# EasyEDA Pro project 光磁共振实验仪.eprj, schematic 恒流源模块
Create Date: 2025-03-18; Page Name: P1; Project Name: 光磁共振实验仪; Schematic Name: 恒流源模块; Update Date: 2025-04-30; Company: 嘉立创EDA; Page Size: A4; Version: V1.0
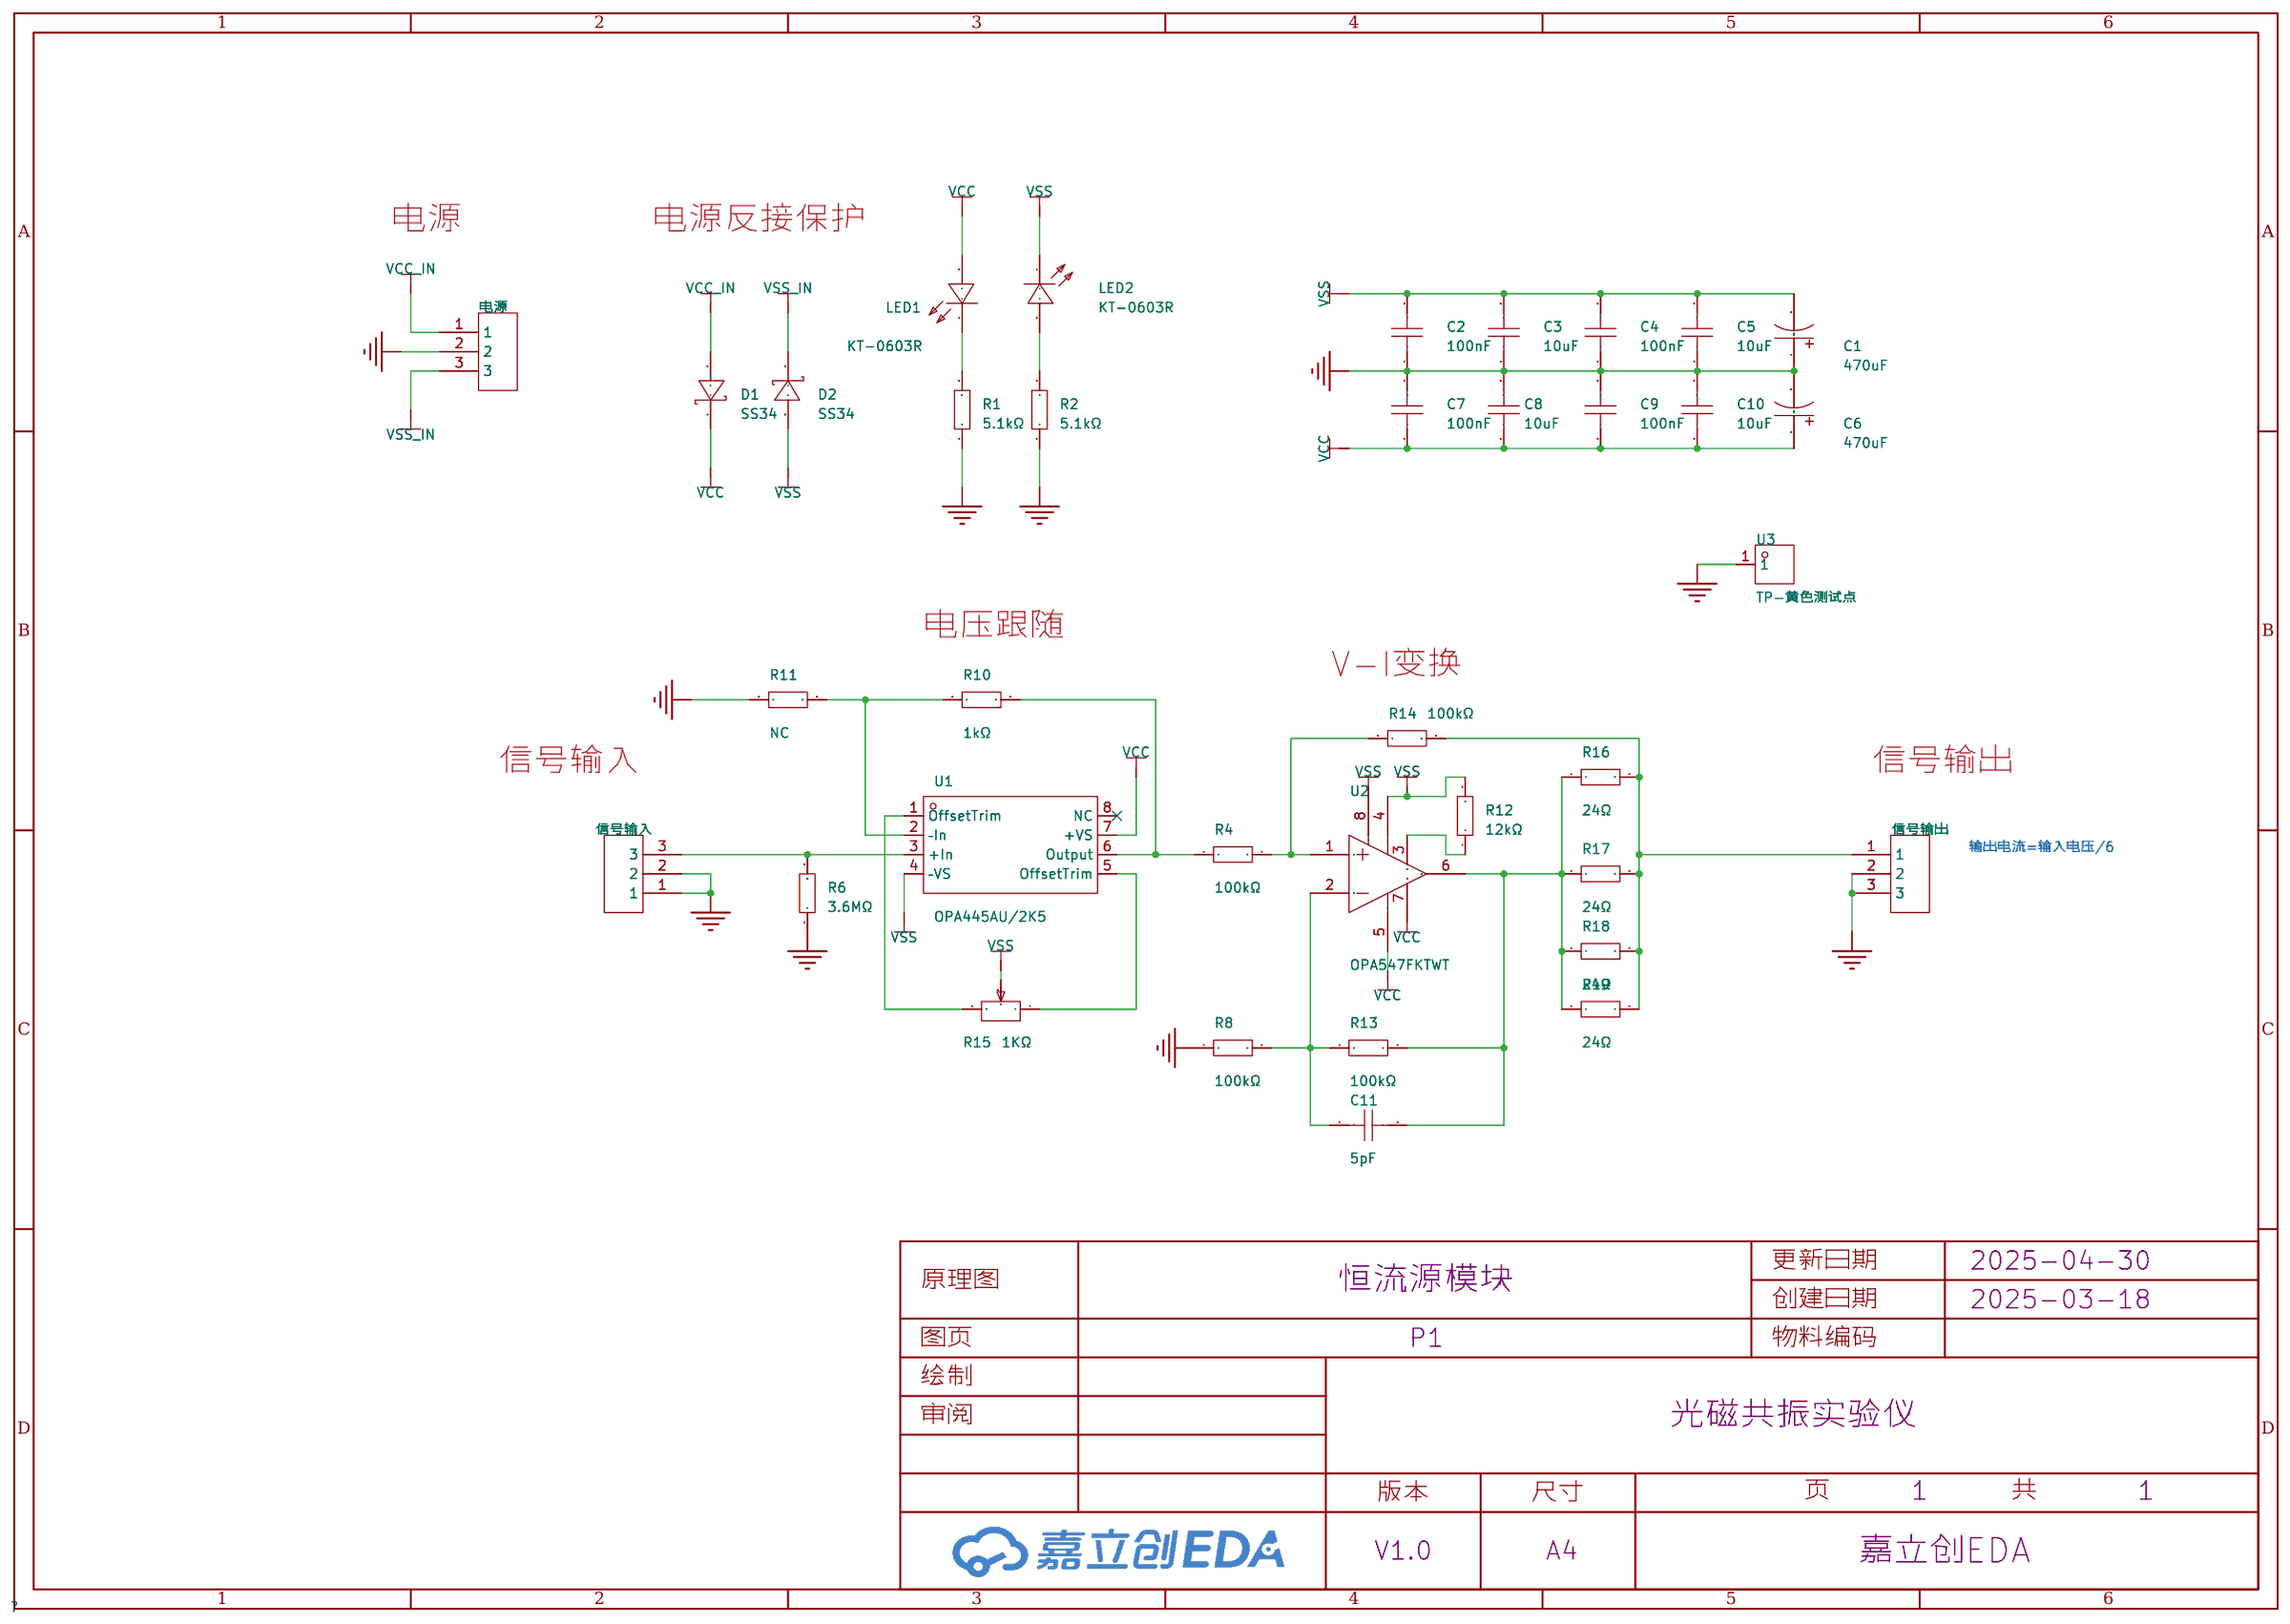
[diagram p3: schematic sheet]

## Parts
C1  470uF  [cap-th_bd8.0-p3.50-d0.6-fd_1]
C2  100nF  [C0603]
C3  10uF  [C0603]
C4  100nF  [C0603]
C5  10uF  [C0603]
C6  470uF  [cap-th_bd8.0-p3.50-d0.6-fd_1]
C7  100nF  [C0603]
C8  10uF  [C0603]
C9  100nF  [C0603]
C10  10uF  [C0603]
C11  5pF  [C0603]
D1  SS34  [SMA_L4.3-W2.6-LS5.2-RD]
D2  SS34  [SMA_L4.3-W2.6-LS5.2-RD]
LED1  KT-0603R  [LED0603-RD]
LED2  KT-0603R  [LED0603-RD]
R1  5.1kΩ  [R0603]
R2  5.1kΩ  [R0603]
R4  100kΩ  [R0603]
R6  3.6MΩ  [R0603]
R8  100kΩ  [R0603]
R10  1kΩ  [R0603]
R11  NC  [R0603]
R12  12kΩ  [R0603]
R13  100kΩ  [R0603]
R14  100kΩ  [R0603]
R15  1KΩ  [RES-ADJ-TH_3296W]
R16  24Ω  [R2512]
R17  24Ω  [R2512]
R18  24Ω  [R2512]
R19  24Ω  [R2512]
U1  OPA445AU/2K5  [SOIC-8_L4.9-W3.9-P1.27-LS6.0-BL]
U2  OPA547FKTWT  [DDPAK-7_L10.2-W8.9-P1.27-LS14.0-BR]
U3  TP-黄色测试点  [TESTPOINT-TH_BD3.2]
信号输入  -  [CH2.54-3插座]
信号输出  -  [CH2.54-3插座]
电源  -  [CH2.54-3插座]

## Library data of the parts
C1 C6 = RVT1A471M0607_C335982: 容值:470uF;精度:±20%;额定电压:10V;纹波电流:200mA@120Hz;等效串联电阻:-;; LCSC Part Name: 470uF ±20% 10V; Supplier Part: C335982; Manufacturer: ROQANG(容强); Manufacturer Part: RVT1A471M0607; Supplier Footprint: SMD,D6.3xL7.7mm; Datasheet: https://atta.szlcsc.com/upload/public/pdf/source/20181128/C335987_23CA7AA50FB42690DF736C43FE112376.pdf; Supplier: LCSC; Tolerance: ±20%; Rated Voltage: 10V; Ripple Current: 200mA@120Hz; φD: 6.3mm; L: 7.7mm; Lifetime @ Temp: 2000hrs@105℃; Operating Temperature: -40℃~+105℃
C2 C4 C7 C9 = CC0603KRX7R9BB104: 容值:100nF;精度:±10%;额定电压:50V;材质(温度系数):X7R;; LCSC Part Name: 100nF ±10% 50V; Supplier Part: C14663; Manufacturer: YAGEO(国巨); Supplier Footprint: 0603; JLCPCB Part Class: 基础库; Datasheet: https://atta.szlcsc.com/upload/public/pdf/source/20180910/C282072_33301C7F631E79921B82A8DAC6BCC5B3.pdf; Supplier: LCSC; Tolerance: ±10%; Voltage Rated: 50V; Temperature Coefficient: X7R
C3 C5 C8 C10 = CL10A106MA8NRNC: 容值:10uF;精度:±20%;额定电压:25V;材质(温度系数):X5R;; LCSC Part Name: 10uF ±20% 25V; Supplier Part: C96446; Manufacturer: SAMSUNG(三星); Supplier Footprint: 0603; JLCPCB Part Class: 基础库; Datasheet: https://atta.szlcsc.com/upload/public/pdf/source/20160218/1457707763339.pdf; Supplier: LCSC; Tolerance: ±20%; Voltage Rated: 25V; Temperature Coefficient: X5R
C11 = CGA3E2C0G2A050C080AA: 容值:5pF;额定电压:100V;材质(温度系数):C0G;; LCSC Part Name: 5pF 100V ±0.25pF; Supplier Part: C3879212; Manufacturer: TDK; Supplier Footprint: 0603; JLCPCB Part Class: 扩展库; Datasheet: https://atta.szlcsc.com/upload/public/pdf/source/20230606/D94174B26D5D12F87246C65F1689D091.pdf; Supplier: LCSC; Voltage Rated: 100V; Temperature Coefficient: C0G
D1 D2 = SS34_C8678: 二极管配置:独立式;正向压降(Vf):550mV@3A;直流反向耐压(Vr):40V;整流电流:3A;; LCSC Part Name: 电压:40V 电流:3A; Supplier Part: C8678; Manufacturer: MDD(辰达半导体); Supplier Footprint: SMA(DO-214AC); JLCPCB Part Class: 基础库; Datasheet: https://atta.szlcsc.com/upload/public/pdf/source/20240710/2118BB86FDDB2E0B294389AC1F3F65C8.pdf; Supplier: LCSC; Diode Configuration: 独立式; Forward Voltage (Vf@If): 550mV@3A; Reverse Voltage (Vr): 40V; Rectified Current: 3A; Reverse Leakage Current (Ir): 500uA@40V
LED1 LED2 = KT-0603R: 发光颜色:红色;功率:-;正向电流:-;主波长:-;二极管配置:-;透镜颜色:-;色温:-;发光角度:-;载带方式:-;工作温度:-40℃~+85℃;; LCSC Part Name: 0603 红灯 高亮; Supplier Part: C2286; Manufacturer: KENTO; Supplier Footprint: 0603; JLCPCB Part Class: 基础库; Datasheet: https://atta.szlcsc.com/upload/public/pdf/source/20160616/1466072038404.pdf; Supplier: LCSC; Emitted Color: 红色; Operating Temperature: -40℃~+85℃
R1 R2 = 0603WAF5101T5E: 电阻类型:厚膜电阻;阻值:5.1kΩ;精度:±1%;功率:100mW;最大工作电压:75V;温度系数:±100ppm/℃;; LCSC Part Name: 5.1kΩ ±1% 100mW 厚膜电阻; Supplier Part: C23186; Manufacturer: UNI-ROYAL(厚声); Supplier Footprint: 0603; JLCPCB Part Class: 基础库; Datasheet: https://atta.szlcsc.com/upload/public/pdf/source/20200306/C422600_1E6D84923E4A46A82E41ADD87F860B5C.pdf; Supplier: LCSC; Type: 厚膜电阻; Tolerance: ±1%; Power(Watts): 100mW; Overload Voltage (Max): 75V; Temperature Coefficient: ±100ppm/℃; Operating Temperature Range: -55℃~+155℃
R4 R8 R13 R14 = 0603WAF1003T5E: 电阻类型:厚膜电阻;阻值:100kΩ;精度:±1%;功率:100mW;最大工作电压:75V;温度系数:±100ppm/℃;; LCSC Part Name: 100kΩ ±1% 100mW 厚膜电阻; Supplier Part: C25803; Manufacturer: UNI-ROYAL(厚声); Supplier Footprint: 0603; JLCPCB Part Class: 基础库; Datasheet: https://atta.szlcsc.com/upload/public/pdf/source/20200306/C422600_1E6D84923E4A46A82E41ADD87F860B5C.pdf; Supplier: LCSC; Type: 厚膜电阻; Tolerance: ±1%; Power(Watts): 100mW; Overload Voltage (Max): 75V; Temperature Coefficient: ±100ppm/℃; Operating Temperature Range: -55℃~+155℃
R6 = RTT03365JTP: 电阻类型:厚膜电阻;阻值:3.6MΩ;精度:±5%;功率:100mW;最大工作电压:75V;温度系数:±100ppm/℃;; LCSC Part Name: 厚膜电阻 3.6MΩ ±5% 100mW; Supplier Part: C103584; Manufacturer: RALEC(旺诠); Supplier Footprint: 0603; JLCPCB Part Class: 扩展库; Datasheet: https://atta.szlcsc.com/upload/public/pdf/source/20191219/C158410_884373A5B7E1BC76BF57BC45A946C093.pdf; Supplier: LCSC; Type: 厚膜电阻; Tolerance: ±5%; Power(Watts): 100mW; Overload Voltage (Max): 75V; Temperature Coefficient: ±100ppm/℃; Operating Temperature Range: -55℃~+155℃
R10 R11 = 0603WAF1001T5E: 电阻类型:厚膜电阻;阻值:1kΩ;精度:±1%;功率:100mW;最大工作电压:75V;温度系数:±100ppm/℃;; LCSC Part Name: 1kΩ ±1% 100mW 厚膜电阻; Supplier Part: C21190; Manufacturer: UNI-ROYAL(厚声); Supplier Footprint: 0603; JLCPCB Part Class: 基础库; Datasheet: https://atta.szlcsc.com/upload/public/pdf/source/20200306/C422600_1E6D84923E4A46A82E41ADD87F860B5C.pdf; Supplier: LCSC; Type: 厚膜电阻; Tolerance: ±1%; Power(Watts): 100mW; Overload Voltage (Max): 75V; Temperature Coefficient: ±100ppm/℃; Operating Temperature Range: -55℃~+155℃
R12 = 0603WAF1202T5E: 电阻类型:厚膜电阻;阻值:12kΩ;精度:±1%;功率:100mW;最大工作电压:75V;温度系数:±100ppm/℃;; LCSC Part Name: 12kΩ ±1% 100mW 厚膜电阻; Supplier Part: C22790; Manufacturer: UNI-ROYAL(厚声); Supplier Footprint: 0603; JLCPCB Part Class: 基础库; Datasheet: https://atta.szlcsc.com/upload/public/pdf/source/20200306/C422600_1E6D84923E4A46A82E41ADD87F860B5C.pdf; Supplier: LCSC; Type: 厚膜电阻; Tolerance: ±1%; Power(Watts): 100mW; Overload Voltage (Max): 75V; Temperature Coefficient: ±100ppm/℃; Operating Temperature Range: -55℃~+155℃
R15 = 环保 3296W-1-202LF: 阻值:-;功率:-;; LCSC Part Name: 2KΩ ±10% ±250ppm/℃; Supplier Part: C5028; Supplier Footprint: 3296W; JLCPCB Part Class: 扩展库; Supplier: LCSC
R16-R19 = CRH2512F24R0E04Z: 电阻类型:厚膜电阻;阻值:24Ω;精度:±1%;功率:2W;最大工作电压:200V;温度系数:±100ppm/℃;; LCSC Part Name: 厚膜电阻 24Ω ±1% 2W; Supplier Part: C175254; Manufacturer: EVER OHMS(天二科技); Supplier Footprint: 2512; JLCPCB Part Class: 扩展库; Datasheet: https://atta.szlcsc.com/upload/public/pdf/source/20190415/C175809_DD1C9F6158BC05995187FFAA24C3E24C.pdf; Supplier: LCSC; Type: 厚膜电阻; Tolerance: ±1%; Power(Watts): 2W; Overload Voltage (Max): 200V; Temperature Coefficient: ±100ppm/℃; Operating Temperature Range: -55℃~+155℃
U1 = OPA445AU/2K5: OPA445 高电压 FET 输入运算放大器; Supplier Part: C1348606; Manufacturer: TI(德州仪器); Supplier Footprint: SOIC-8; JLCPCB Part Class: 扩展库; Datasheet: https://www.ti.com/cn/lit/gpn/opa445; Supplier: LCSC
U2 = OPA547FKTWT: 放大器数:单路;增益带宽积(GBP):1MHz;输入偏置电流(Ib):100nA;压摆率(SR):6V/us;带宽(-3db):-;; Supplier Part: C2057541; Manufacturer: TI(德州仪器); Supplier Footprint: TO-263-7; JLCPCB Part Class: 扩展库; Datasheet: https://www.ti.com/cn/lit/gpn/opa547; Supplier: LCSC; Number of Circuits: 单路; Gain Bandwidth Product(GBP): 1MHz; Current - Input Bias(Ib): 100nA; Slew Rate(SR): 6V/us; Output Current: 750mA; Operating Temperature: -40℃~+85℃
U3 = TP-黄色测试点: Supplier Part: C9900007422; Supplier Footprint: TESTPOINT-TH_BD-2P-P2.00; JLCPCB Part Class: 扩展库; Supplier: LCSC
信号输入 信号输出 电源 = HDR-3P

## Nets
GND: C1.1 C2.1 C3.1 C4.1 C5.1 C6.2 C7.2 C8.2 C9.2 C10.2 R1.1 R2.1 R6.1 R8.1 R11.1 U3.1 信号输入.1 信号输入.2 信号输出.2 信号输出.3 电源.2
VCC: C6.1 C7.1 C8.1 C9.1 C10.1 D1.1(K) LED1.2(A) U1.7(+VS) U2.5(V+) U2.7(E/S)
VCC_IN: D1.2(A) 电源.1
VSS: C1.2 C2.2 C3.2 C4.2 C5.2 D2.2(A) LED2.1(K) R12.2 R15.2 U1.4(–VS) U2.4(V-) U2.8(V-)
VSS_IN: D2.1(K) 电源.3
$1N1624: R10.1 R11.2 U1.2(–In)
$1N1631: R4.1 R10.2 U1.6(Output)
$1N1633: C11.1 R8.2 R13.1 U2.2(IN-)
$1N1634: C11.2 R13.2 R16.1 R17.1 R18.1 R19.1 U2.6(OUT)
$1N1636: R4.2 R14.1 U2.1(IN+)
$1N1639: R12.1 U2.3(ILIM)
$1N1642: R14.2 R16.2 R17.2 R18.2 R19.2 信号输出.1
$1N1651: R6.2 U1.3(+In) 信号输入.3
$1N1652: LED1.1(K) R1.2
$1N1653: LED2.2(A) R2.2
Net-(R15-1): R15.1 U1.5(OffsetTrim)
Net-(R15-3): R15.3 U1.1(OffsetTrim)

Not connected (* = marked no-connect by the designer): U1 8(NC)*

## Notes on the sheet
- 电源
- 电源反接保护
- 电压跟随
- V-I变换
- 信号输入
- 信号输出
- 输出电流=输入电压/6
